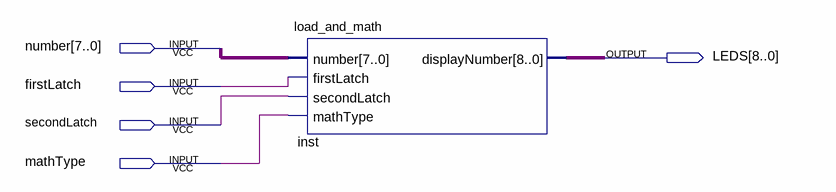
[diagram p0: schematic sheet]
// Quartus schematic BinMath.bdf as structural Verilog: 1 symbols, 5 pins
module BinMath (
  input  [7:0] number,
  input  firstLatch,
  input  secondLatch,
  input  mathType,
  output [8:0] LEDS
);

  load_and_math inst (
    .number(number), .firstLatch(firstLatch), .secondLatch(secondLatch), .mathType(mathType),
    .displayNumber(LEDS));
endmodule
